# Altium schematic sheet Audio.SchDoc
size A4
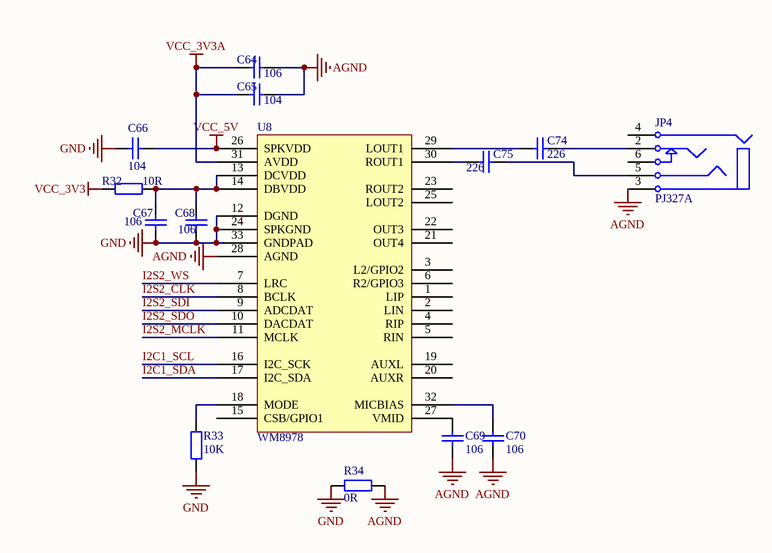
[diagram p0: Audio.SchDoc]

## Parts
C64  106  [C0402_M]
C65  104  [C0402_M]
C66  104  [C0402_M]
C67  106  [C0402_M]
C68  106  [C0402_M]
C69  106  [C0402_M]
C70  106  [C0402_M]
C74  226  [C0805_M]
C75  226  [C0805_M]
JP4  PJ327A  [PJ327A]
R32  10R  [R0603_M]
R33  10K  [R0402_M]
R34  0R  [R0603_M]
U8  WM8978  [QFN32 5x5_N]

## Nets
AGND: C64.1 C65.1 C69.1 C70.1 JP4.3 R34.1 U8.28(AGND)
GND: C66.1 C67.2 C68.2 R33.1 R34.2 U8.12(DGND) U8.24(SPKGND) U8.33(GNDPAD)
VCC_3V3: R32.2
VCC_3V3A: C64.2 C65.2 U8.31(AVDD)
VCC_5V: C66.2 U8.26(SPKVDD)
I2C1_SCL: U8.16(I2C_SCK)
I2C1_SDA: U8.17(I2C_SDA)
I2S2_CLK: U8.8(BCLK)
I2S2_MCLK: U8.11(MCLK)
I2S2_SDI: U8.9(ADCDAT)
I2S2_SDO: U8.10(DACDAT)
I2S2_WS: U8.7(LRC)
NetC67_1: C67.1 C68.1 R32.1 U8.13(DCVDD) U8.14(DBVDD)
NetC69_2: C69.2 U8.27(VMID)
NetC70_2: C70.2 U8.32(MICBIAS)
NetC74_1: C74.1 U8.29(LOUT1)
NetC74_2: C74.2 JP4.2
NetC75_1: C75.1 U8.30(ROUT1)
NetC75_2: C75.2 JP4.5
NetR33_2: R33.2 U8.18(MODE)

Not connected (* = marked no-connect by the designer): JP4 4 6; U8 1(LIP) 2(LIN) 3(L2/GPIO2) 4(RIP) 5(RIN) 6(R2/GPIO3) 15(CSB/GPIO1) 19(AUXL) 20(AUXR) 21(OUT4) 22(OUT3) 23(ROUT2) 25(LOUT2)

## Library data of the parts
C64-C70 C74 C75 = C: 贴片电容/MLCC电容; BOM名称: 无极性贴片电容; 联系卖家，免费查找封装: 唯一出售店铺网址https://shop463601444.taobao.com
JP4 = PJ327A: 3.5mm音频接口
R32-R34 = R: 贴片电阻; 联系卖家，免费查找封装: 唯一出售店铺网址https://shop463601444.taobao.com; BOM名称: 贴片电阻